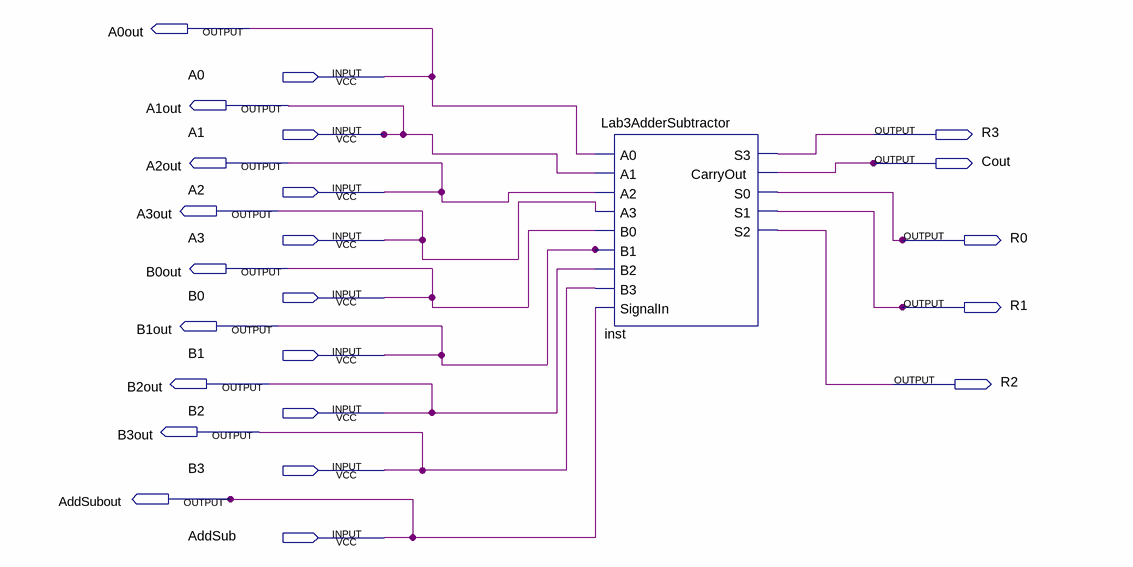
[diagram p0: schematic sheet]
// Quartus schematic Lab4DE3.bdf as structural Verilog: 1 symbols, 23 pins
module Lab4DE3 (
  input  A0,
  input  A1,
  input  A2,
  input  A3,
  input  B0,
  input  B1,
  input  B2,
  input  B3,
  input  AddSub,
  output A0out,
  output A1out,
  output R3,
  output A2out,
  output Cout,
  output A3out,
  output R0,
  output B0out,
  output R1,
  output B1out,
  output B2out,
  output R2,
  output B3out,
  output AddSubout
);

  Lab3AdderSubtractor inst (
    .A0(A0), .A1(A1), .A2(A2), .A3(A3), .B0(B0), .B1(B1), .B2(B2), .B3(B3), .SignalIn(AddSub), .S3(R3),
    .CarryOut(Cout), .S0(R0), .S1(R1), .S2(R2));

  assign A0out = A0;
  assign A1out = A1;
  assign A2out = A2;
  assign A3out = A3;
  assign AddSubout = AddSub;
  assign B0out = B0;
  assign B1out = B1;
  assign B2out = B2;
  assign B3out = B3;
endmodule
